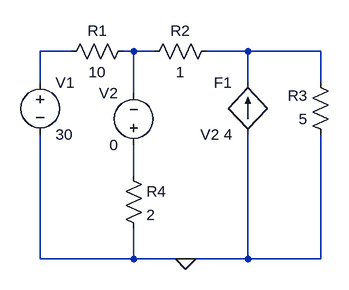
[diagram p0: schematic Draft15.asc]
Draft15.asc, the LTspice schematic file:
Version 4
SHEET 1 880 680
WIRE 96 48 48 48
WIRE 192 48 176 48
WIRE 224 48 192 48
WIRE 368 48 304 48
WIRE 480 48 368 48
WIRE 48 96 48 48
WIRE 368 96 368 48
WIRE 480 96 480 48
WIRE 192 112 192 48
WIRE 192 240 192 192
WIRE 48 368 48 176
WIRE 192 368 192 320
WIRE 192 368 48 368
WIRE 272 368 192 368
WIRE 368 368 368 176
WIRE 368 368 272 368
WIRE 480 368 480 176
WIRE 480 368 368 368
FLAG 272 368 0
SYMBOL voltage 48 80 R0
SYMATTR InstName V1
SYMATTR Value 30
SYMBOL res 192 32 R90
WINDOW 0 0 56 VBottom 2
WINDOW 3 32 56 VTop 2
SYMATTR InstName R1
SYMATTR Value 10
SYMBOL res 320 32 R90
WINDOW 0 0 56 VBottom 2
WINDOW 3 32 56 VTop 2
SYMATTR InstName R2
SYMATTR Value 1
SYMBOL res 496 192 R180
WINDOW 0 36 76 Left 2
WINDOW 3 36 40 Left 2
SYMATTR InstName R3
SYMATTR Value 5
SYMBOL f 368 176 R180
WINDOW 0 24 80 Left 2
WINDOW 3 24 0 Left 2
SYMATTR InstName F1
SYMATTR Value V2 4
SYMBOL voltage 192 208 R180
WINDOW 0 24 96 Left 2
WINDOW 3 24 16 Left 2
SYMATTR InstName V2
SYMATTR Value 0
SYMBOL res 176 224 R0
SYMATTR InstName R4
SYMATTR Value 2

The netlist it stands for:
* Draft15.asc
V1 N001 0 30
R1 N002 N001 10
R2 N003 N002 1
R3 0 N003 5
F1 0 N003 V2 4
V2 N004 N002 0
R4 N004 0 2
.backanno
.end